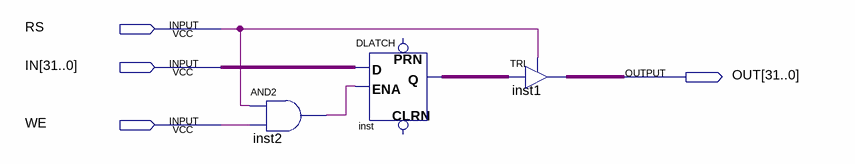
[diagram p0: schematic sheet]
// Quartus schematic MC1x32.bdf as structural Verilog: 3 symbols, 4 pins
module MC1x32 (
  input  RS,
  input  [31:0] IN,
  input  WE,
  output [31:0] OUT
);

  wire inst2_out;
  wire [31:0] inst_q;

  and inst2 (inst2_out, RS, WE);
  DLATCH inst[31:0] (.D(IN), .ENA(inst2_out), .Q(inst_q));  // open: CLRN, PRN
  TRI inst1[31:0] (.IN(inst_q), .OE(RS), .OUT(OUT));
endmodule
